# Altium schematic sheet WX0.008.511DL(4).SchDoc
size A3
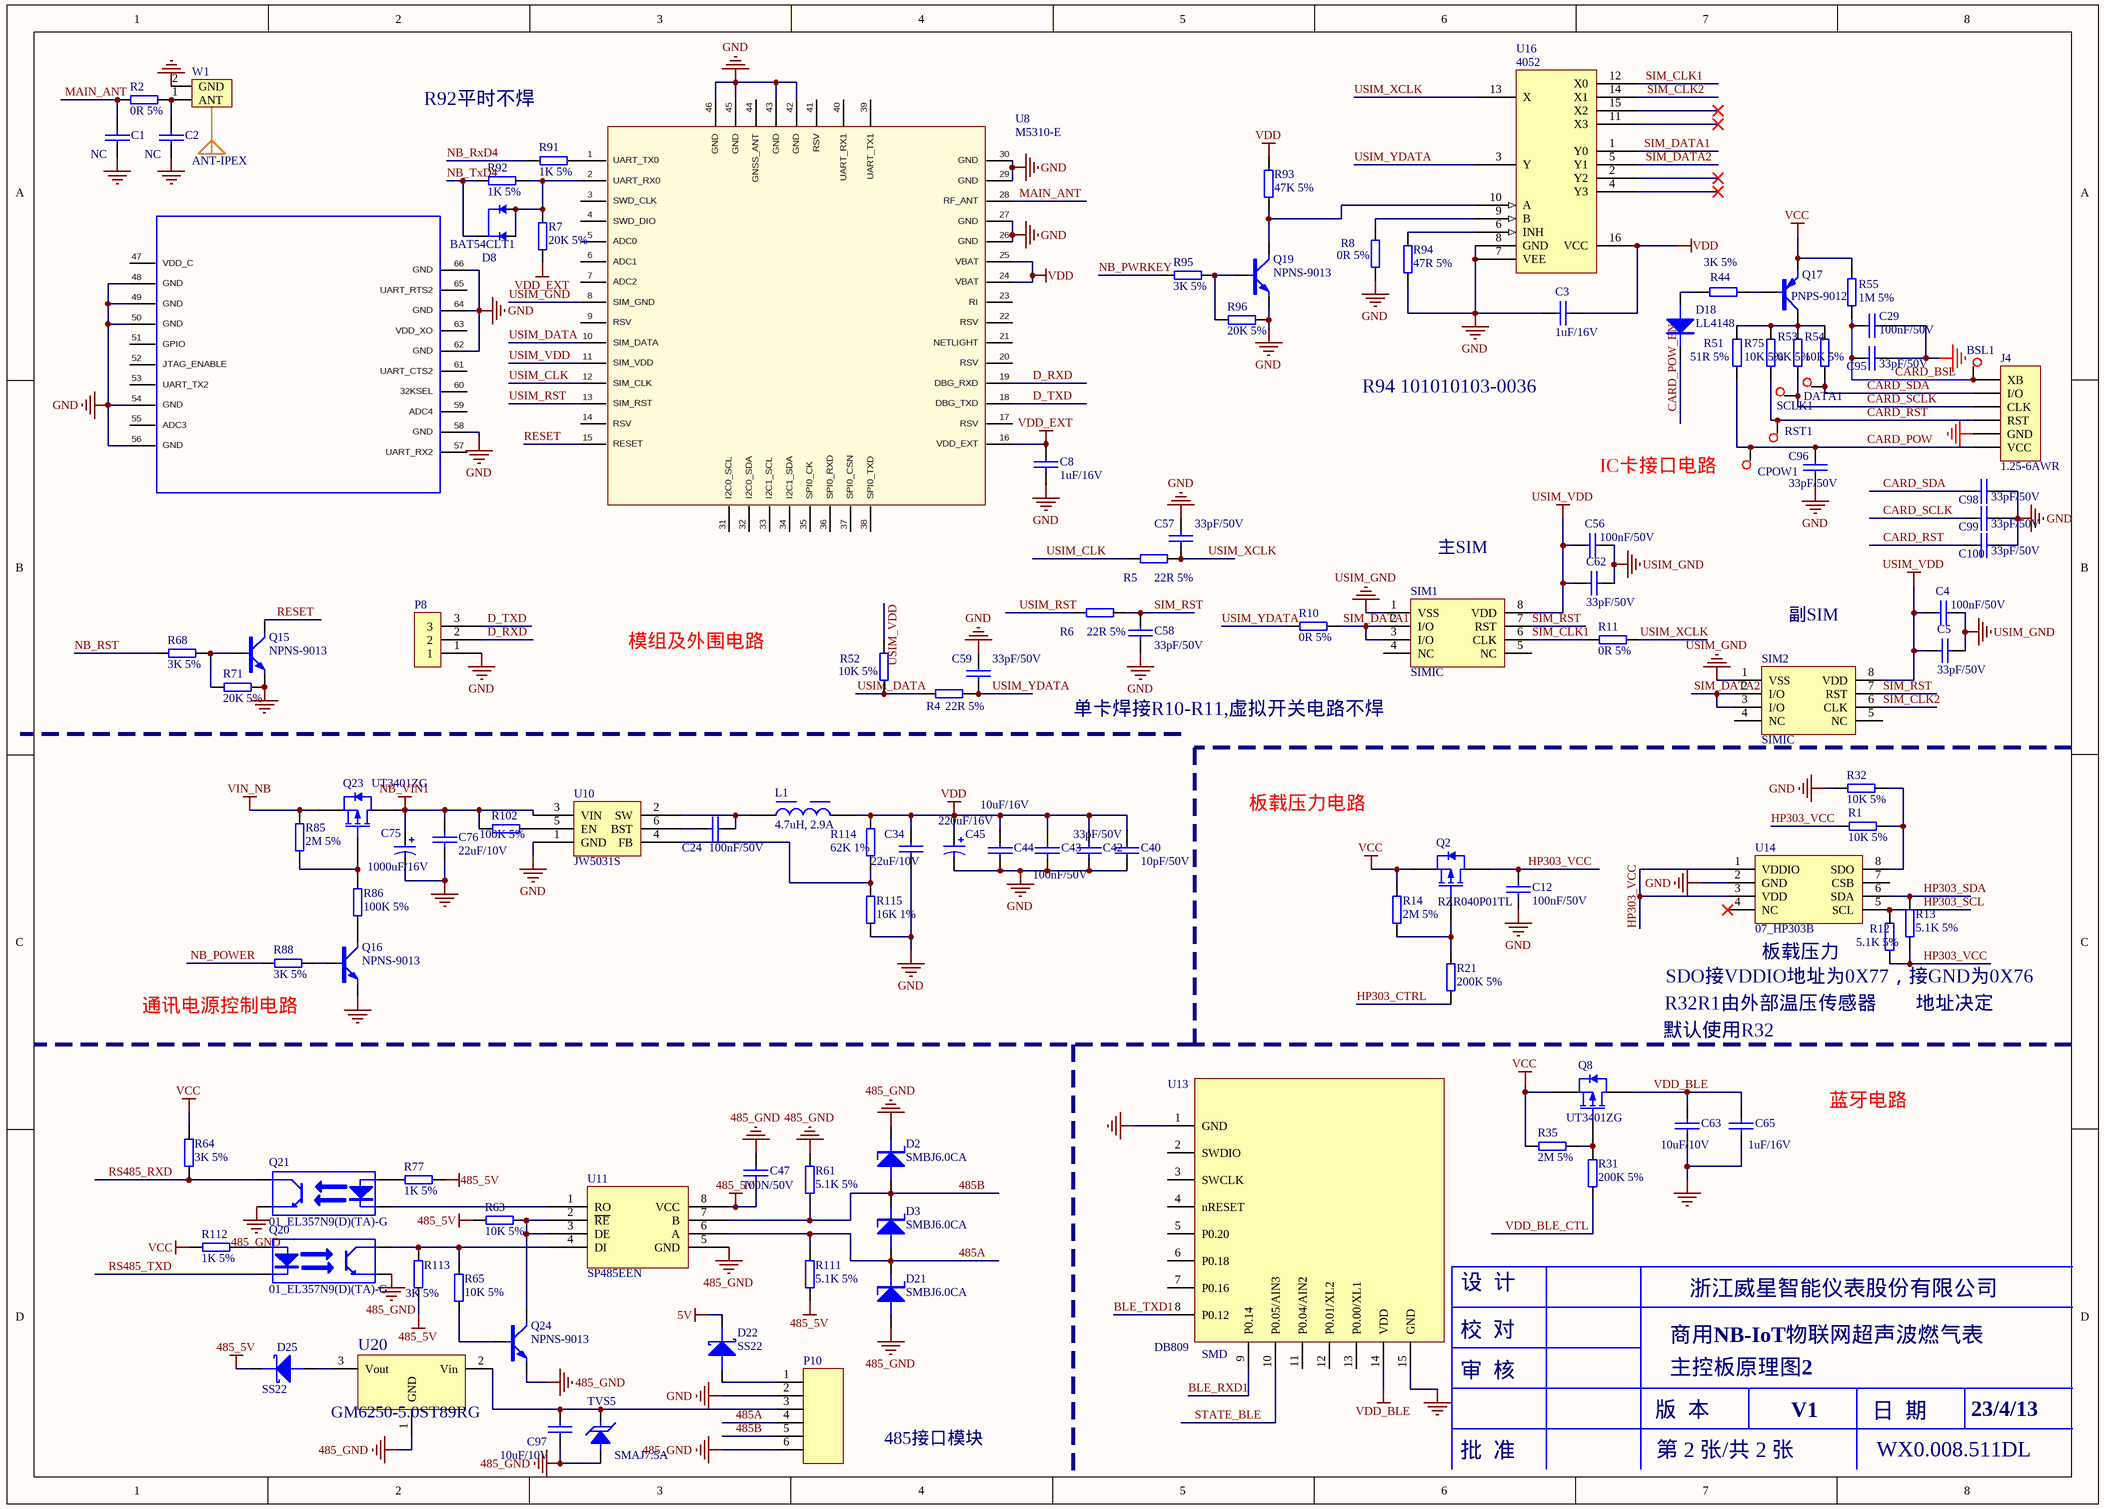
[diagram p0: WX0.008.511DL(4).SchDoc]

## Parts
BSL1  TEST-PAD  [TEST-PAD]  (value not drawn)
C1  NC  [CAP0603]
C2  NC  [CAP0603]
C3  1uF/16V  [CAP0603]
C4  100nF/50V  [CAP0603]
C5  33pF/50V  [CAP0603]
C8  1uF/16V  [CAP0603]
C12  100nF/50V  [CAP0603]
C24  100nF/50V  [CAP0603]
C29  100nF/50V  [CAP0603]
C34  22uF/10V  [CAP0805]
C40  10pF/50V  [CAP0603]
C42  33pF/50V  [CAP0603]
C43  100nF/50V  [CAP0603]
C44  10uF/16V  [CAP1206]
C45  220uF/16V  [220uf/16V]
C47  100N/50V  [CAP0603]
C56  100nF/50V  [CAP0603]
C57  33pF/50V  [CAP0603]
C58  33pF/50V  [CAP0603]
C59  33pF/50V  [CAP0603]
C62  33pF/50V  [CAP0603]
C63  10uF/10V  [CAP0603]
C65  1uF/16V  [CAP0603]
C75  1000uF/16V  [CAP-SMD_BD10.0-L10.3-W10.3-FD]
C76  22uF/10V  [CAP0805]
C95  33pF/50V  [CAP0603]
C96  33pF/50V  [CAP0603]
C97  10uF/10V  [CAP0603]
C98  33pF/50V  [CAP0603]
C99  33pF/50V  [CAP0603]
C100  33pF/50V  [CAP0603]
CPOW1  TEST-PAD  [TEST-PAD]  (value not drawn)
D2  SMBJ6.0CA  [5025D]
D3  SMBJ6.0CA  [5025D]
D8  BAT54CLT1  [SOT-23]
D18  LL4148  [SOD-123FL]
D21  SMBJ6.0CA  [5025D]
D22  SS22  [DO-214AC]
D25  SS22  [DO-214AC]
DATA1  TEST-PAD  [TEST-PAD]  (value not drawn)
J4  1.25-6AWR  [SMT-1.25-6]
L1  4.7uH, 2.9A  [WE-MAPI_4020]
P8  Component_2  [PCBComponent_1 - duplicate]  (value not drawn)
P10  (no value)  [6Pin插座]
Q2  RZR040P01TL  [SOT-23]
Q8  UT3401ZG  [SOT-23]
Q15  NPNS-9013  [SOT-23]
Q16  NPNS-9013  [SOT-23]
Q17  PNPS-9012  [SOT-23]
Q19  NPNS-9013  [SOT-23]
Q20  01_EL357N9(D)(TA)-G  [EL357D]
Q21  01_EL357N9(D)(TA)-G  [EL357D]
Q23  UT3401ZG  [SOT-23]
Q24  NPNS-9013  [SOT-23]
R1  10K 5%  [RES0603]
R2  0R 5%  [RES0603]
R4  22R 5%  [RES0603]
R5  22R 5%  [RES0603]
R6  22R 5%  [RES0603]
R7  20K 5%  [RES0603]
R8  0R 5%  [RES0603]
R10  0R 5%  [RES0603]
R11  0R 5%  [RES0603]
R12  5.1K 5%  [RES0603]
R13  5.1K 5%  [RES0603]
R14  2M 5%  [RES0603]
R21  200K 5%  [RES0603]
R31  200K 5%  [RES0603]
R32  10K 5%  [RES0603]
R35  2M 5%  [RES0603]
R44  3K 5%  [RES0603]
R51  51R 5%  [RES1206]
R52  10K 5%  [RES0603]
R53  10K 5%  [RES0603]
R54  10K 5%  [RES0603]
R55  1M 5%  [RES0603]
R61  5.1K 5%  [RES0603]
R63  10K 5%  [RES0603]
R64  3K 5%  [RES0603]
R65  10K 5%  [RES0603]
R68  3K 5%  [RES0603]
R71  20K 5%  [RES0603]
R75  10K 5%  [RES0603]
R77  1K 5%  [RES0603]
R85  2M 5%  [RES0603]
R86  100K 5%  [RES0603]
R88  3K 5%  [RES0603]
R91  1K 5%  [RES0603]
R92  1K 5%  [RES0603]
R93  47K 5%  [RES0603]
R94  47R 5%  [RES0603]
R95  3K 5%  [RES0603]
R96  20K 5%  [RES0603]
R102  100K 5%  [RES0603]
R111  5.1K 5%  [RES0603]
R112  1K 5%  [RES0603]
R113  3K 5%  [RES0603]
R114  62K 1%  [RES0603]
R115  16K 1%  [RES0603]
RST1  TEST-PAD  [TEST-PAD]  (value not drawn)
SCLK1  TEST-PAD  [TEST-PAD]  (value not drawn)
SIM1  SIMIC  [SIMIC]
SIM2  SIMIC  [SIMIC]
TVS5  SMAJ7.5A  [PCBComponent_1 - duplicate4]
U8  M5310-E  [M5310-E]
U10  JW5031S  [PCBComponent_1 - duplicate1]
U11  SP485EEN  [SOP8]
U13  DB809  SMD/DIP: SMD  [DB809]
U14  07_HP303B  [HP303B]
U16  4052  [SIM卡转换开关]
U20  GM6250-5.0ST89RG  [SOT-89]
W1  ANT-IPEX  [ANT-IPEX_1]

## Nets
5V: D22.2
485_5V: C47.2 D25.2 R63.1 R77.2 R111.1 R113.1 U11.8(VCC)
485_GND: C47.1 C97.2 D2.2(K) D21.1(A) P10.6(GND) Q20.3 Q21.3 Q24.2(E) R61.2 TVS5.1 U11.5(GND) U20.1(GND)
GND: C1.2 C2.2 C3.1 C8.2 C12.2 C29.1 C34.2 C40.2 C42.2 C43.1 C44.2 C45.2 C57.2 C58.2 C59.2 C63.2 C65.2 C75.2 C76.2 C95.2 C96.1 C98.2 C99.2 C100.2 J4.5(GND) P8.1 P10.2(UD-) Q15.2(E) Q16.2(E) Q19.2(E) R8.1 R32.2 R71.2 R94.2 R96.2 R115.1 U8.26(GND) U8.27(GND) U8.29(GND) U8.30(GND) U8.42(GND) U8.43(GND) U8.45(GND) U8.46(GND) U8.48(GND) U8.49(GND) U8.50(GND) U8.54(GND) U8.56(GND) U8.58(GND) U8.62(GND) U8.64(GND) U8.66(GND) U10.1(GND) U13.1(GND) U13.15(GND) U14.2(GND) U16.7(VEE) U16.8(GND) W1.2(GND)
NB_VIN1: C75.1 C76.1 Q23.3(D) R102.1 U10.3(VIN)
USIM_GND: C4.2 C5.2 C56.2 C62.2 SIM1.1(VSS) SIM2.1(VSS) U8.8(SIM_GND)
USIM_VDD: C4.1 C5.1 C56.1 C62.1 R52.2 SIM1.8(VDD) SIM2.8(VDD) U8.11(SIM_VDD)
VCC: Q2.2(S) Q8.2(S) Q17.2(E) R14.1 R35.1 R55.2 R64.2 R112.1
VDD: C3.2 C34.1 C40.1 C42.1 C43.2 C44.1 C45.1 L1.2 R93.2 R114.1 U8.24(VBAT) U8.25(VBAT) U16.16(VCC)
VDD_BLE: C63.1 C65.1 Q8.3(D) U13.14(VDD)
VDD_EXT: C8.1 R7.2 U8.16(VDD_EXT)
VIN_NB: Q23.2(S) R85.1
485A: D3.1(A) D21.2(K) P10.4(GND) R111.2 U11.6(A)
485B: D2.1(A) D3.2(K) P10.5(GND) R61.1 U11.7(B)
BLE_RXD1: U13.9(P0.14)
BLE_TXD1: U13.8(P0.12)
CARD_BSL: BSL1.1 C29.2 C95.1 J4.1(XB) R55.1
CARD_POW: C96.2 CPOW1.1 J4.6(VCC) R51.1
CARD_POW_EN: D18.2
CARD_RST: C100.1 J4.4(RST) R75.2 RST1.1
CARD_SCLK: C99.1 J4.3(CLK) R53.2 SCLK1.1
CARD_SDA: C98.1 DATA1.1 J4.2(I/O) R54.2
D_RXD: P8.2 U8.19(DBG_RXD)
D_TXD: P8.3 U8.18(DBG_TXD)
HP303_CTRL: R21.1
HP303_SCL: R12.2 U14.5(SCL)
HP303_SDA: R13.2 U14.6(SDA)
HP303_VCC: C12.1 Q2.3(D) R1.2 R12.1 R13.1 U14.1(VDDIO) U14.3(VDD)
MAIN_ANT: C1.1 R2.2 U8.28(RF_ANT)
NB_POWER: R88.2
NB_PWRKEY: R95.1
NB_RST: R68.2
NB_RxD4: R91.2
NB_TxD4: D8.3(C) R92.2
RESET: Q15.3(C) U8.15(RESET)
RS485_RXD: Q21.4 R64.1
RS485_TXD: Q20.2
SIM_CLK1: R11.1 SIM1.6(CLK) U16.12(X0)
SIM_CLK2: SIM2.6(CLK) U16.14(X1)
SIM_DATA1: R10.2 SIM1.2(I/O) SIM1.3(I/O) U16.1(Y0)
SIM_DATA2: SIM2.2(I/O) SIM2.3(I/O) U16.5(Y1)
SIM_RST: C58.1 R6.2 SIM1.7(RST) SIM2.7(RST)
STATE_BLE: U13.10(P0.05/AIN3)
USIM_CLK: R5.1 U8.12(SIM_CLK)
USIM_DATA: R4.1 R52.1 U8.10(SIM_DATA)
USIM_RST: R6.1 U8.13(SIM_RST)
USIM_XCLK: C57.1 R5.2 R11.2 U16.13(X)
USIM_YDATA: C59.1 R4.2 R10.1 U16.3(Y)
VDD_BLE_CTL: R31.1
NetC2_1: C2.1 R2.1 W1.1(ANT)
NetC24_1: C24.1 L1.1 U10.2(SW)
NetC24_2: C24.2 U10.6(BST)
NetC97_1: C97.1 P10.3(UD+) TVS5.2 U20.2(Vin)
NetD8_1: D8.1(A) D8.2(A) R7.1 R92.1 U8.2(UART_RX0)
NetD18_1: D18.1 R44.1
NetD22_1: D22.1 P10.1(VCC)
NetD25_1: D25.1 U20.3(Vout)
NetQ2_1: Q2.1(G) R14.2 R21.2
NetQ8_1: Q8.1(G) R31.2 R35.2
NetQ15_1: Q15.1(B) R68.1 R71.1
NetQ16_1: Q16.1(B) R88.1
NetQ16_3: Q16.3(C) R86.1
NetQ17_1: Q17.1(B) R44.2
NetQ17_3: Q17.3(C) R51.2 R53.1 R54.1 R75.1
NetQ19_1: Q19.1(B) R95.2 R96.1
NetQ19_3: Q19.3(C) R93.1 U16.10(A)
NetQ20_1: Q20.1 R112.2
NetQ20_4: Q20.4 R65.2 R113.2 U11.4(DI)
NetQ21_1: Q21.1 R77.1
NetQ21_2: Q21.2 U11.1(RO)
NetQ23_1: Q23.1(G) R85.2 R86.2
NetQ24_1: Q24.1(B) R65.1
NetQ24_3: Q24.3(C) R63.2 U11.2(~{RE}) U11.3(DE)
NetR1_1: R1.1 R32.1 U14.8(SDO)
NetR8_2: R8.2 U16.9(B)
NetR91_1: R91.1 U8.1(UART_TX0)
NetR94_1: R94.1 U16.6(INH)
NetR102_2: R102.2 U10.5(EN)
NetR114_2: R114.2 R115.2 U10.4(FB)

Not connected (* = marked no-connect by the designer): SIM1 4(NC) 5(NC); SIM2 4(NC) 5(NC); U8 3(SWD_CLK) 4(SWD_DIO) 5(ADC0) 6(ADC1) 7(ADC2) 9(RSV) 14(RSV) 17(RSV) 20(RSV) 21(NETLIGHT) 22(RSV) 23(RI) 31(I2C0_SCL) 32(I2C0_SDA) 33(I2C1_SCL) 34(I2C1_SDA) 35(SPI0_CK) 36(SPI0_RXD) 37(SPI0_CSN) 38(SPI0_TXD) 39(UART_TX1) 40(UART_RX1) 41(RSV) 44(GNSS_ANT) 47(VDD_C) 51(GPIO) 52(JTAG_ENABLE) 53(UART_TX2) 55(ADC3) 57(UART_RX2) 59(ADC4) 60(32KSEL) 61(UART_CTS2) 63(VDD_XO) 65(UART_RTS2); U13 2(SWDIO) 3(SWCLK) 4(nRESET) 5(P0.20) 6(P0.18) 7(P0.16) 11(P0.04/AIN2) 12(P0.01/XL2) 13(P0.00/XL1); U14 4(NC)* 7(CSB); U16 2(Y2)* 4(Y3)* 11(X3)* 15(X2)*

## Notes on the sheet
- (near U8) R92平时不焊
- R94 101010103-0036
- IC卡接口电路
- 主SIM
- 模组及外围电路
- 副SIM
- 单卡焊接R10-R11,虚拟开关电路不焊
- 板载压力电路
- (near R12) SDO接VDDIO地址为0X77，接GND为0X76
- (near U14) 板载压力
- 通讯电源控制电路
- 默认使用R32
- R32R1由外部温压传感器
- 地址决定
- 蓝牙电路
- (near U13) 设  计
- 浙江威星智能仪表股份有限公司
- (near U13) 审  核
- (near U13) 校  对
- 商用NB-IoT物联网超声波燃气表
- 主控板原理图2
- 485接口模块
- 批  准
- 版  本
- 第 2 张/共 2 张
- V1
- 日  期
- WX0.008.511DL
- 23/4/13

## Library data of the parts
BSL1 CPOW1 DATA1 RST1 SCLK1 = AD_WXHJ_TEST-PAD_01: 单面焊盘测试点; Part Name: 测试点; ID: 23; SMD/DIP: SMD; Part Number: AD_WXHJ_TEST-PAD_01
C1 C2 C4 C12 C24 C29 C43 C56 = 101020103-0021: 104pF,50 V,±10%,0603,国巨,CC0603KRX7R9BB104; Part Name: 0603贴片电容; ID: 3; SMD/DIP: SMD; Part Number: 101020103-0021
C3 C8 C65 = 101020103-0003: 105pF,16 V,±10%,0603,国巨,CC0603KRX7R7BB105; Part Name: 0603贴片电容; ID: 14; SMD/DIP: SMD; Part Number: 101020103-0003
C5 C42 C57-C59 C62 = 101020103-0027: 33pF,50 V,±10%,0603,国巨,CC0603KRNPO9BN33; Part Name: 0603贴片电容; ID: 17; SMD/DIP: SMD; Part Number: 101020103-0027
C34 C76 = 101020102-0012: 226P,10 V,±20%,0805,村田电子有限公司,GRM21BR61A226ME51L; Part Name: 贴片电容; ID: 20; SMD/DIP: SMD; Part Number: 101020102-0012
C40 = 101020103-0014: 10pF,50 V,±5%,0603,X7R,国巨,CC0603JRNPO9BN100; Part Name: 0603贴片电容; ID: 7; SMD/DIP: SMD; Part Number: 101020103-0014
C44 = 101020101-0005: 106P,16 V,±10%,1206,国巨,CC1206KRNPO7BN106P; Part Name: 1206贴片电容; ID: 9; SMD/DIP: SMD; Part Number: 101020101-0005
C45 C75 = 1010203-0029: 1000uF,16 V,±20%,8*20mm,Rubycon,16ZLH1000M; Part Name: 电解电容; ID: 2; SMD/DIP: DIP; Part Number: 1010203-0029
C47 = 101020103-0021: 100N/50V，±10%，0603; Part Name: 0603贴片电容; ID: 34; Part Number: 101020103-0021
C63 C97 = 101020103-0026: 106pF,10 V,±10%,0603,村田,GRM188R61A106KE47D; Part Name: 0603贴片电容; ID: 8; SMD/DIP: SMD; Part Number: 101020103-0026
C95 C96 C98-C100 = 101020103-0027: 33pF,50 V,±10%,0603,国巨,CC0603KRNPO9BN33; Part Name: 0603贴片电容; ID: 18; SMD/DIP: SMD; Part Number: 101020103-0027
D2 D3 D21 = 101040101-0024: SMBJ6.0CA，6V单向TVS管; Part Name: TVS管; ID: 29; Part Number: 101040101-0024
D8 = 101040101-0038: BAT54CLT1，SOT23-3,SOT23-3,0.2 A,0.8 V,30 V,安森美,BAT54CLT1; Part Name: 贴片肖特基; ID: 31; SMD/DIP: SMD; Part Number: 101040101-0038
D18 = 101040101-0005: 4148,4148,0.2 A,1 V,100 V,先科,LL4148; Part Name: 贴片二极管; Text Field1: 010101020002; Text Field2: 10; ID: 11; SMD/DIP: SMD; Part Number: 101040101-0005
D22 D25 = 101040101-0055: DS36W,SOD123-FL,3 A,42 V,60 V,浙江领晨科技有限公司,DS36W; Part Name: 贴片肖特基; ID: 40; SMD/DIP: SMD; Part Number: 101040101-0055
J4 = 1010902-0121: 1.25-6AWR 卷,6针1.25mm,母头,单排,贴片卧式; Part Name: 插座; ID: 32; SMD/DIP: SMD; Part Number: 1010902-0121
L1 = 74438356047: WE-MAPI SMT Power Inductor, size 4020, 4.7uH, 2.9A; Manufacturer: Wurth Elektronik; DC Resistance typ.: 63mOhm; DC Resistance max.: 76mOhm; Self Resonant Frequency: 22MHz; Saturation Current: 4.7A; ComponentLink1Description: Manufacturer; ComponentLink1URL: http://www.we-online.de; ComponentLink2Description: Datasheet; ComponentLink2URL: https://www.we-online.com/catalog/datasheet/74438356047.pdf; Mounting Technology: SMT; Operating Temperature: -40 to +125degC; Packaging: Tape and Reel; Published Date: December 2020; Size: 4020; Inductance: 4.7uH; Manufacturer Part Number: 74438356047; Rated Current: 2.9A
P10 = 1010902-0119: Micro usb 5P/F B Type dip 有导位无柱7.2(外壳加焊盘脚长1.1),商品号：C40951，深圳嘉立创商城,micro usb-p1.1,母头,单排,Micro usb 5P/F B Type dip 有导位无柱7.2(外壳加焊盘脚长1.1); Part Name: MicroUSB座; ID: 9; SMD/DIP: SMD; Part Number: 1010902-0119
Q2 = 101040201-0010: RZR040P01TL；1.5v导通,P-MOS,SOT-23,罗姆,RZR040P01TL; Part Name: PMOS管; ID: 18; SMD/DIP: SMD; Part Number: 101040201-0010
Q8 = 101040201-0013: UT3401ZG,P-MOS,SOT-23,UTC,UT3401ZG; Part Name: 功率MOS管; ID: 18; SMD/DIP: SMD; Part Number: 101040201-0013
Q15 Q16 Q19 Q24 = 101040201-0002: 9013,NPN,SOT-23,长电,S9013; Part Name: 贴片三极管; ID: 15; SMD/DIP: SMD; Part Number: 101040201-0002
Q17 = 101040201-0001: 9012,PNP,SOT-23,JCET;长电,S9012; Part Name: 贴片三极管; ID: 17; SMD/DIP: SMD; Part Number: 101040201-0001
Q20 Q21 = 1010502-0045: Part Name: 贴片光耦; ID: 31; Part Number: 1010502-0045
Q23 = 101040201-0013: UT3401ZG,P-MOS,SOT-23,UTC,UT3401ZG; Part Name: 功率MOS管; ID: 19; SMD/DIP: SMD; Part Number: 101040201-0013
R1 R32 = 101010103-0002: 国巨,±5%,0603,,155 ℃,-55 ℃,RC0603JR-071ML,无铅,200 ppm/℃,1/10W,,1M; Part Name: 0603贴片电阻; ID: 11; SMD/DIP: SMD; Part Number: 101010103-0002
R2 R8 R10 R11 = 101010103-0001: 国巨,±5%,0603,,155 ℃,-55 ℃,RC0603J2-070RL,无铅,200 ppm/℃,1/10W,,0R; Part Name: 0603贴片电阻; ID: 1; SMD/DIP: SMD; Part Number: 101010103-0001
R4-R6 = 101010103-0009: 国巨,±5%,0603,,155 ℃,-55 ℃,RC0603JR-0722RL,无铅,200 ppm/℃,1/10W,,22欧; Part Name: 0603贴片电阻; ID: 17; SMD/DIP: SMD; Part Number: 101010103-0009
R7 R71 R96 = 101010103-0004: 国巨,±5%,0603,,155 ℃,-55 ℃,RC0603JR-0720KL,无铅,200 ppm/℃,1/10W,,20K; Part Name: 0603贴片电阻; ID: 15; SMD/DIP: SMD; Part Number: 101010103-0004
R12 R13 = 101010103-0015: 国巨,±5%,0603,,155 ℃,55 ℃,RC0603JR-075.1KL,无铅,200 ppm/℃,1/10W,,5.1k; Part Name: 0603贴片电阻; ID: 27; SMD/DIP: SMD; Part Number: 101010103-0015
R14 R85 = 101010103-0025: 国巨,±5%,0603,,155 ℃,-55 ℃,RC0603JR-072ML,含铅,100 ppm/℃,1/10W,,2M; Part Name: 0603贴片电阻; ID: 20; SMD/DIP: SMD; Part Number: 101010103-0025
R21 = 101010103-0034: 200K,±5%,1/10W,0603,国巨,RC0603JR-07200KL; Part Name: 0603贴片电阻; ID: 13; SMD/DIP: SMD; Part Number: 101010103-0034
R31 R35 R63 R65 = 101010103-0003: 10K±5%,1/10W,0603; Part Name: 0603贴片电阻; ID: 32; Part Number: 101010103-0003
R44 = 101010103-0006: 国巨,±5%,0603,,155 ℃,-55 ℃,RC0603JR-073KL,无铅,100 ppm/℃,1/10W,,3K; Part Name: 0603贴片电阻; ID: 22; SMD/DIP: SMD; Part Number: 101010103-0006
R51 = 101010101-0029: 51Ω,±5%,1/4W,1206,国巨,RC1206JR-0751RL; Part Name: 1206贴片电阻; ID: 28; SMD/DIP: SMD; Part Number: 101010101-0029
R52-R54 R75 R115 = 101010103-0003: 国巨,±5%,0603,,155 ℃,-55 ℃,RC0603JR-0710KL,无铅,200 ppm/℃,1/10W,,10K; Part Name: 0603贴片电阻; ID: 7; SMD/DIP: SMD; Part Number: 101010103-0003
R55 = 101010103-0002: 国巨,±5%,0603,,155 ℃,-55 ℃,RC0603JR-071ML,无铅,200 ppm/℃,1/10W,,1M; Part Name: 0603贴片电阻; ID: 10; SMD/DIP: SMD; Part Number: 101010103-0002
R61 R111 = 101010103-0015: 5.1K±5%,1/10W,0603; Part Name: 0603贴片电阻; ID: 63; Part Number: 101010103-0015
R64 R113 = 101010103-0006: 3K±5%,1/10W,0603; Part Name: 0603贴片电阻; ID: 56; Part Number: 101010103-0006
R68 R95 = 101010103-0006: 国巨,±5%,0603,,155 ℃,-55 ℃,RC0603JR-073KL,无铅,100 ppm/℃,1/10W,,3K; Part Name: 0603贴片电阻; ID: 23; SMD/DIP: SMD; Part Number: 101010103-0006
R77 R112 = 101010103-0008: 1K±5%,1/10W,0603; Part Name: 0603贴片电阻; ID: 38; Part Number: 101010103-0008
R86 R102 = 101010103-0005: 国巨,±5%,0603,,155 ℃,-55 ℃,RC0603JR-07100KL,无铅,100 ppm/℃,1/10W,,100K; Part Name: 0603贴片电阻; ID: 3; SMD/DIP: SMD; Part Number: 101010103-0005
R88 = 101010103-0006: 国巨,±5%,0603,,155 ℃,-55 ℃,RC0603JR-073KL,无铅,100 ppm/℃,1/10W,,3K; Part Name: 0603贴片电阻; ID: 27; SMD/DIP: SMD; Part Number: 101010103-0006
R91 R92 = 101010103-0008: 1K,±5%,1/10W,0603,国巨,RC0603JR-071KL; Part Name: 0603贴片电阻; ID: 10; SMD/DIP: SMD; Part Number: 101010103-0008
R93 = 101010103-0012: 47K,±5%,1/10W,0603,国巨,RC0603JR-0747KL; Part Name: 0603贴片电阻; ID: 26; SMD/DIP: SMD; Part Number: 101010103-0012
R94 = 101010103-0009: 国巨,±5%,0603,,155 ℃,-55 ℃,RC0603JR-0722RL,无铅,200 ppm/℃,1/10W,,22欧; Part Name: 0603贴片电阻; SMD/DIP: SMD; ID: 18; Part Number: 101010103-0009
R114 = 101010103-0067: 国巨,±5%,0603,,155 ℃,-55 ℃,RC0603JR,含铅,100 ppm/℃,1/10W,,22k; Part Name: 0603贴片电阻; ID: 17; SMD/DIP: SMD; Part Number: 101010103-0067
SIM1 SIM2 = AD_XN_SIMIC_01: SIMIC虚拟器件; ID: 21; SMD/DIP: SMD; Part Number: AD_XN_SIMIC_01; Part Name: SIMIC
TVS5 = 101040101-0024: SMBJ6.0CA,DO-214AA,10.3 V,6.0 V,600 W,58.3 A,800 uA,上海君耀电子有限公司,SMBJ6.0CA; Part Name: TVS管; ID: 23; SMD/DIP: SMD; Part Number: 101040101-0024
U8 = 1011402-0235: M5310-E MBRH0S00,/,电信、移动NB-IoT,19mm*18.4mm*2.2mm，LCC+LGA贴片式封装,B5,B8,BLE 5.0,中移物联网有限公司; Part Name: NB-IOT模块; ID: 26; SMD/DIP: SMD; Part Number: 1011402-0235
U10 = Component_3
U11 = 101050101-0065: SP485EEN,SOP8; Part Name: 485芯片; ID: 27; Part Number: 101050101-0065
U13 = 1011402-0194: 北高智蓝牙模块DB809; Part Name: 蓝牙模块; ID: 15; Part Number: 1011402-0194
U14 = 1011301-0022: HP303B,4.7mm*3.7mm,惠贻华普,HP303B,含铅; Part Name: HP303B温压传感器; ID: 27; SMD/DIP: SMD; Part Number: 1011301-0022
U16 = Pro87.tmp_4052_23
U20 = 1010503-0021: GM6250-5.0ST89RG,GM6250-5.0ST89RG,SOT-89,12 V,0 V,0 V,5 V,250mA,1.0 uA,美国GAMMA; ID: 3; SMD/DIP: SMD; Part Number: 1010503-0021; Part Name: GM6250-5.0ST89RG
W1 = 1010902-0145: UB06000058A,3*3.1*1.25mm,公头,单排,IPEX一代板端; Part Name: IPEX座; ID: 31; SMD/DIP: SMD; Part Number: 1010902-0145